# EasyEDA Pro project 神奇的按键.eprj

# Schematic Schematic1
Create Date: 2022-07-01; Project Name: 神奇的按键; Schematic Name: Schematic1; Update Date: 2022-07-01
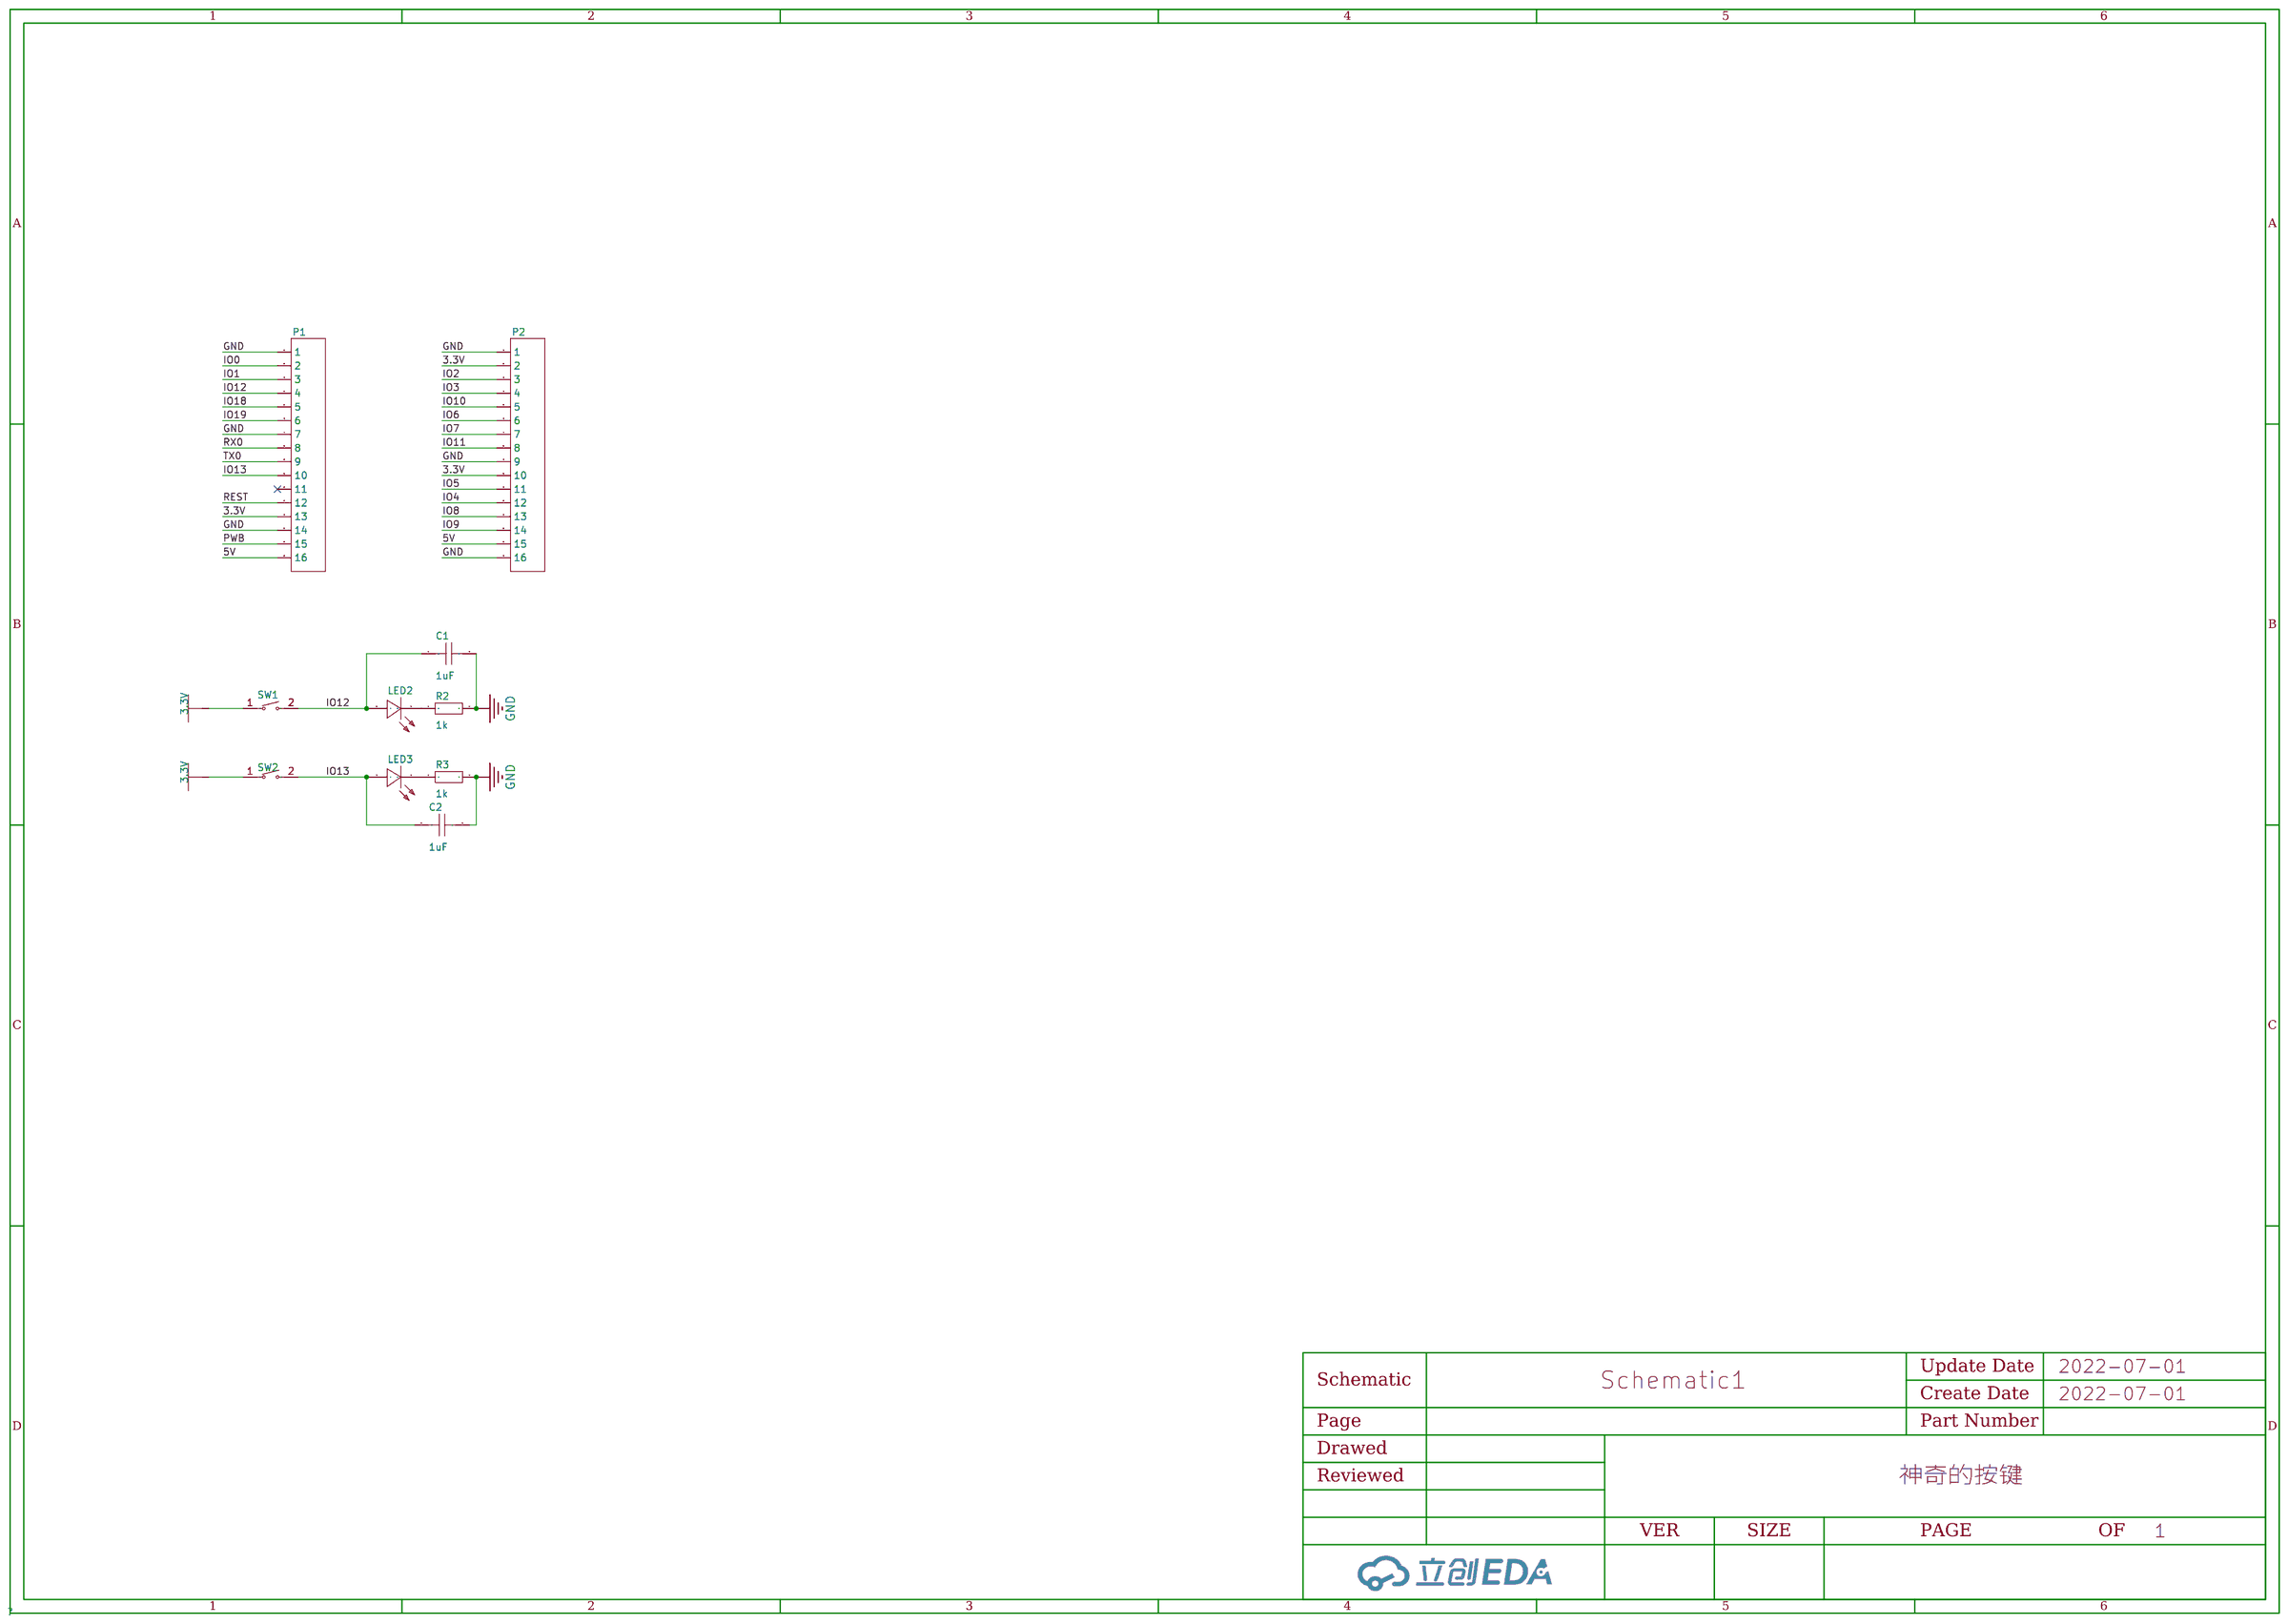
[diagram p0: schematic sheet]

## Parts
C1  1uF  [C1206]
C2  1uF  [C1206]
LED2  -  [LED1206-RD_ORANGE]
LED3  -  [LED1206-RD_ORANGE]
P1  -  [HDR-TH_16P-P2.54-V-F-1]
P2  -  [HDR-TH_16P-P2.54-V-F-1]
R2  1k  [R1206]
R3  1k  [R1206]
SW1  -  [SW-TH_CPG151101D9X]
SW2  -  [SW-TH_CPG151101D9X]

## Library data of the parts
C1 C2 = CL31B105KBHNNNE: 容值:1uF;精度:±10%;额定电压:50V;温度系数:X7R;; LCSC Part Name: 1uF ±10% 50V; Supplier Part: C1848; Manufacturer: SAMSUNG(三星); Supplier Footprint: 1206; JLCPCB Part Class: Basic Part; Datasheet: https://atta.szlcsc.com/upload/public/pdf/source/20160103/1457707700211.pdf; Supplier: LCSC; Tolerance: ±10%; Voltage Rated: 50V; Temperature Coefficient: X7R
LED2 LED3 = SZYY1206O: 发光颜色:橙灯;二极管配置:-;透镜颜色:无色透明;主波长:598nm~608nm;峰值波长:612nm;色温:-;光通量(25时):-;测试电流:10mA;正向电压(VF):2.4V;发光强度:175mcd;功率:40mW;发光角度:120°;安装方式:-;工作温度:-40~+85;; LCSC Part Name: 橙灯; Supplier Part: C434444; Manufacturer: yongyu(永裕光电); Supplier Footprint: 1206; JLCPCB Part Class: Extended Part; Datasheet: https://atta.szlcsc.com/upload/public/pdf/source/20200628/C434444_6ECB98FD1A7DFA4E2730C4AB27077783.pdf; Supplier: LCSC; Emitted Color: 橙灯; Lens Color: 无色透明; Dominant Wavelength: 598nm~608nm; Peak Wavelength: 612nm; Forward Current: 10mA; Forward Voltage (VF): 2.4V; Luminous Intensity: 175mcd; Power Dissipation: 40mW; Viewing Angle: 120°; Operating Temperature: -40~+85
P1 P2 = 2.54-1*16P母: 间距:2.54mm;总孔位数:16;排数:1;行距:-;安装类型:直插;塑高:-;触头材质:-;触头镀层:-;; LCSC Part Name: 1x16P 2.54mm; Supplier Part: C66987; Manufacturer: BOOMELE(博穆精密); Supplier Footprint: 插件,P=2.54mm; JLCPCB Part Class: Extended Part; Supplier: LCSC; Pitch: 2.54mm; Number of Holes: 16; Number of Rows: 1; Mounting Type: 直插
R2 R3 = 1206W4J0102T5E: 电阻类型:厚膜电阻;阻值:1k;精度:±5%;功率:250mW;温度系数:±100ppm/;最大工作电压:200V;工作温度范围:-55~+155;; LCSC Part Name: 1k ±5%; Supplier Part: C1469; Manufacturer: UNI-ROYAL(厚声); Supplier Footprint: 1206; JLCPCB Part Class: Extended Part; Datasheet: https://atta.szlcsc.com/upload/public/pdf/source/20200306/C422600_1E6D84923E4A46A82E41ADD87F860B5C.pdf; Supplier: LCSC; Type: 厚膜电阻; Tolerance: ±5%; Power(Watts): 250mW; Temperature Coefficient: ±100ppm/; Overload Voltage (Max): 200V; Operating Temperature Range: -55~+155
SW1 SW2 = CPG151101D93: LCSC Part Name: KT 红轴; Supplier Part: C400237; Manufacturer: Kailh(凯华); Supplier Footprint: 插件; JLCPCB Part Class: Extended Part; Datasheet: https://atta.szlcsc.com/upload/public/pdf/source/20190626/C400237_8848280669F3C1EEE9452F7570ECFD0E.pdf; Supplier: LCSC

## Nets
3.3V: P1.13 P2.2 P2.10 SW1.1 SW2.1
5V: P1.16 P2.15
GND: C1.2 C2.2 P1.1 P1.7 P1.14 P2.1 P2.9 P2.16 R2.2 R3.2
IO0: P1.2
IO1: P1.3
IO2: P2.3
IO3: P2.4
IO4: P2.12
IO5: P2.11
IO6: P2.6
IO7: P2.7
IO8: P2.13
IO9: P2.14
IO10: P2.5
IO11: P2.8
IO12: C1.1 LED2.2(A) P1.4 SW1.2
IO13: C2.1 LED3.2(A) P1.10 SW2.2
IO18: P1.5
IO19: P1.6
PWB: P1.15
REST: P1.12
RX0: P1.8
TX0: P1.9
$1N2758: LED2.1(K) R2.1
$1N2761: LED3.1(K) R3.1

Not connected (* = marked no-connect by the designer): P1 11*

# Board PCB1
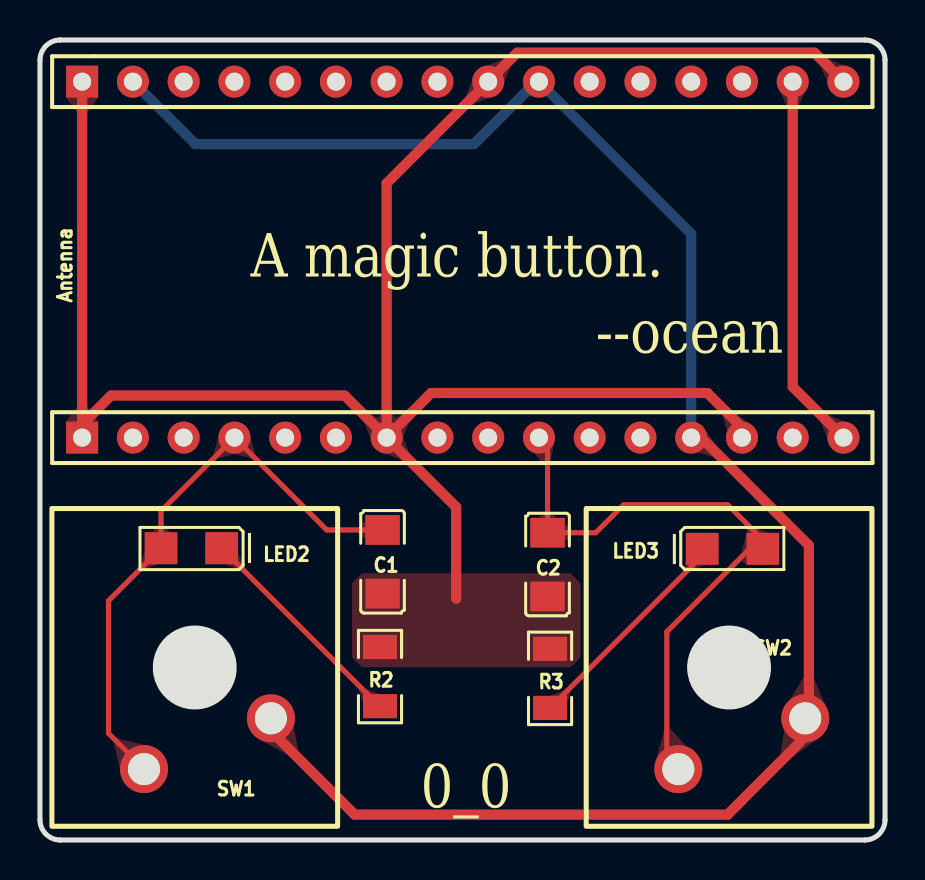
[diagram p1: board, top side]
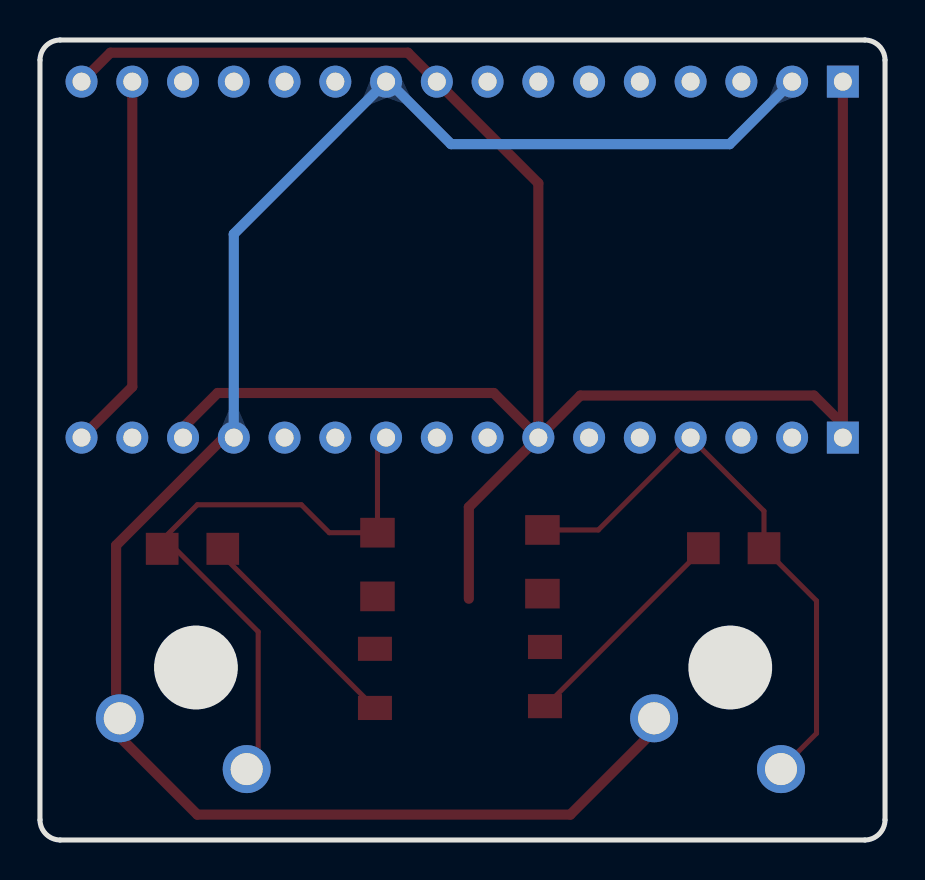
[diagram p2: board, bottom side, seen from below]

Outline 42.29 x 40.01 mm; copper layers: Top Layer, Bottom Layer. Coordinates in mm from the lower left corner of the outline.
Outline path: 0,38.99 0,1.02 arc(0.3,0.3) 1.02,0 41.28,0 arc(41.99,0.3) 42.29,1.02 42.29,38.99 arc(41.99,39.71) 41.28,40.01 1.02,40.01 arc(0.3,39.71) 0,38.99
Stack: Top Layer 0.035mm / 介电1 1.51mm FR4 er 4.5 / Bottom Layer 0.035mm

## Design rules (mm)
spacing safeClearance (default): track to track 0.152, other pairs 0.152 to 0.3
track width trackWidth (default): min 0.127, default 0.254, max 2.54
differential pair differentialPair (default): width min 0.127, default 0.254, max 2.54; gap min 0.152, default 0.152
via viaSize (default): diameter min 0.5, default 0.61, max 10; hole min 0.3, default 0.305, max 6

## Placement (name value [footprint] x y rotation side)
Antenna  -  [HDR-TH_16P-P2.54-V-F-1]  21.16 20.12 0 top
C1  1uF  [C1206]  17.15 13.91 270 top
C2  1uF  [C1206]  25.4 13.77 270 top
LED2  -  [LED1206-RD_ORANGE]  7.58 14.59 180 top
LED3  -  [LED1206-RD_ORANGE]  34.66 14.56 0 top
P2  -  [HDR-TH_16P-P2.54-V-F-1]  21.16 37.92 0 top
R2  1k  [R1206]  17.02 8.17 90 top
R3  1k  [R1206]  25.53 8.08 90 top
SW1  -  [SW-TH_CPG151101D9X]  8.38 4.82 180 top
SW2  -  [SW-TH_CPG151101D9X]  35.12 4.82 180 top

## Footprints (pads in the part's own frame, mm; a bottom-side part is the same pattern mirrored in y, then rotated)
C1206
  rect 1.485x1.728 smd: 1(-1.593,0) 2(1.593,0)
HDR-TH_16P-P2.54-V-F-1
  rect 1.6x1.6 hole 0.899: 1(-19.05,0)
  round 1.6 hole 0.899: 2(-16.51,0) 3(-13.97,0) 4(-11.43,0) 5(-8.89,0) 6(-6.35,0) 7(-3.81,0) 8(-1.27,0) 9(1.27,0) 10(3.81,0) 11(6.35,0) 12(8.89,0) 13(11.43,0) 14(13.97,0) 15(16.51,0) 16(19.05,0)
LED1206-RD_ORANGE
  rect 1.636x1.6 smd: 1(-1.516,0) 2(1.516,0)
R1206
  rect 1.208x1.701 smd: 1(-1.479,0) 2(1.479,0)
SW-TH_CPG151101D9X
  round 2.401 hole 1.6: 1(-3.175,-1.27) 2(3.175,1.27)

## Nets
As in the schematic, except:
3.3V: Antenna.13 P2.2 P2.10 SW1.1 SW2.1
5V: Antenna.16 P2.15
GND: Antenna.1 Antenna.7 Antenna.14 C1.2 C2.2 P2.1 P2.9 P2.16 R2.2 R3.2
IO12: Antenna.4 C1.1 LED2.2 SW1.2
IO13: Antenna.10 C2.1 LED3.2 SW2.2

Pads without a net: Antenna 11

## Routing (per net, layer and track width the routed paths; a pad name or vN(x,y) marks a point on that pad's centre or on a via; arc(x,y) is an arc through that point)
3.3V: length 92.4
  Top Layer w0.508: Antenna.13 33.09,20.12 38.48,14.73 38.48,6.27 SW2.1 38.3,5.15 34.42,1.27 15.75,1.27 11.56,5.46 SW1.1
  Bottom Layer w0.508: Antenna.13 32.59,30.3 P2.10 24.84,37.92 21.72,34.8 7.78,34.8 P2.2
5V: length 18.9
  Top Layer w0.508: P2.15 37.67,22.66 Antenna.16
GND: length 102.8
  Top Layer w0.508: Antenna.7 15.25,22.23 3.56,22.23 2.11,20.78 ; Antenna.7 17.35,32.84 P2.9 23.88,39.37 38.76,39.37 P2.16 ; Antenna.7 19.58,22.35 33.4,22.35 35.13,20.62 Antenna.14 ; Antenna.7 20.83,16.64 20.83,12.06 ; 2.11,20.78 Antenna.1 ; 2.11,20.78 P2.1
IO12: length 29.2
  Top Layer w0.254: C1.1 14.35,15.5 Antenna.4 6.06,16.45 LED2.2 3.43,11.96 3.43,5.33 5.21,3.56 5.21,3.55
IO13: length 31.1
  Top Layer w0.254: Antenna.10 25.4,19.69 C2.1 27.81,15.37 29.21,16.76 34.42,16.76 36.17,15.01 LED3.2 35.52,14.56 31.37,10.41 31.37,4.12 SW2.2
$1N2758: length 11.2
  Top Layer w0.254: 17.02,6.69 16.99,6.69 LED2.1
$1N2761: length 11.1
  Top Layer w0.254: LED3.1 33.14,14.22 R3.1

## Copper pours and planes (outline as drawn; the poured copper is in the pictures)
GND on Top Layer: -0.51,40.77 43.56,40.77 43.56,-1.14 -0.51,-1.14
GND on Top Layer: 15.62,13.34 27.05,13.34 27.05,8.64 15.62,8.64
GND on Bottom Layer: -0.25,40.26 42.67,40.26 42.67,-0.51 -0.25,-0.51
GND on Bottom Layer: -0.25,40.26 42.67,40.26 42.67,-0.51 -0.25,-0.51

Small or netless copper shapes (teardrops, artwork), in the pictures only: 33 on Top Layer, 4 on Bottom Layer

## Text on the board
Top Silkscreen Layer: A magic button. | --ocean | 0_0
